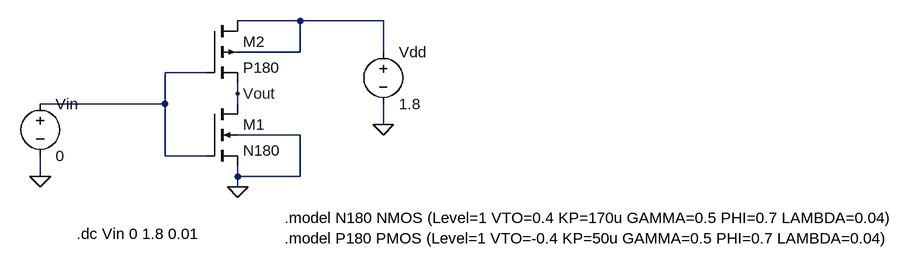
[diagram p0: schematic cmos inverter.asc]
cmos inverter.asc, the LTspice schematic file:
Version 4.1
SHEET 1 1108 680
WIRE 128 -32 32 -32
WIRE 256 -32 128 -32
WIRE 128 16 128 -32
WIRE 128 16 32 16
WIRE 256 16 256 -32
WIRE -16 48 -80 48
WIRE 32 80 32 64
WIRE -80 96 -80 48
WIRE -80 96 -272 96
WIRE 32 96 32 80
WIRE 256 128 256 96
WIRE 128 144 32 144
WIRE -80 176 -80 96
WIRE -16 176 -80 176
WIRE -272 208 -272 176
WIRE 32 208 32 192
WIRE 128 208 128 144
WIRE 128 208 32 208
WIRE 32 224 32 208
FLAG 32 224 0
FLAG -272 208 0
FLAG 256 128 0
FLAG 32 80 Vout
SYMBOL nmos4 -16 96 R0
SYMATTR InstName M1
SYMATTR Value N180
SYMATTR Value2 l=0.18u w=0.54u
SYMBOL pmos4 -16 -32 R0
SYMATTR InstName M2
SYMATTR Value P180
SYMATTR Value2 l=0.18u w=1.08u
SYMBOL voltage 256 0 R0
WINDOW 123 0 0 Left 0
WINDOW 39 0 0 Left 0
SYMATTR InstName Vdd
SYMATTR Value 1.8
SYMBOL voltage -272 80 R0
WINDOW 123 0 0 Left 0
WINDOW 39 0 0 Left 0
SYMATTR InstName Vin
SYMATTR Value 0
TEXT -216 296 Left 2 !.dc Vin 0 1.8 0.01
TEXT 104 272 Left 2 !.model N180 NMOS (Level=1 VTO=0.4 KP=170u GAMMA=0.5 PHI=0.7 LAMBDA=0.04)\n.model P180 PMOS (Level=1 VTO=-0.4 KP=50u GAMMA=0.5 PHI=0.7 LAMBDA=0.04)

The netlist it stands for:
* cmos inverter.asc
M1 Vout N002 0 0 N180 l=0.18u w=0.54u
M2 N001 N002 Vout N001 P180 l=0.18u w=1.08u
Vdd N001 0 1.8
Vin N002 0 0
.model NMOS NMOS
.model PMOS PMOS
.lib standard.mos
.dc Vin 0 1.8 0.01
.model N180 NMOS (Level=1 VTO=0.4 KP=170u GAMMA=0.5 PHI=0.7 LAMBDA=0.04)
.model P180 PMOS (Level=1 VTO=-0.4 KP=50u GAMMA=0.5 PHI=0.7 LAMBDA=0.04)
.backanno
.end